# Altium schematic sheet 主控电路.SchDoc
size 304 x 152 mm
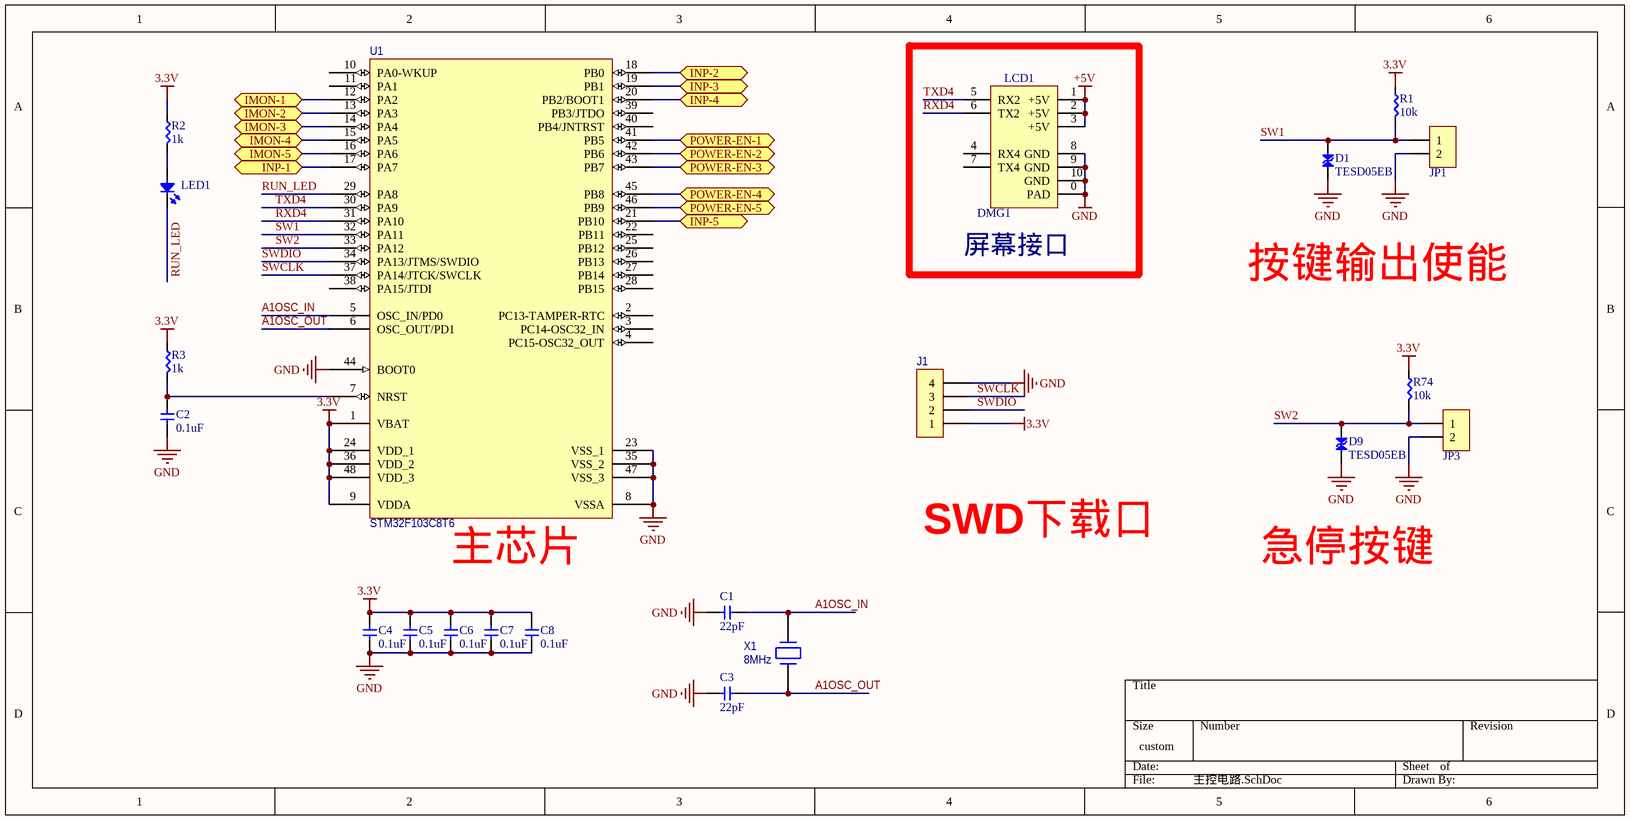
[diagram p0: 主控电路.SchDoc]

## Parts
C1  22pF  [C 0603_M]
C2  0.1uF  [C 0603_M]
C3  22pF  [C 0603_M]
C4  0.1uF  [C 0603_M]
C5  0.1uF  [C 0603_M]
C6  0.1uF  [C 0603_M]
C7  0.1uF  [C 0603_M]
C8  0.1uF  [C 0603_M]
D1  TESD05EB  [0603-ESD]
D9  TESD05EB  [0603-ESD]
DMG1  LCD1  [FCC1.0*10]
J1  swio  [HDR2.54-LI-4P]  (value not drawn)
JP1  HDR-1X2  [XH2.54-LI-2P]  (value not drawn)
JP3  HDR-1X2  [XH2.54-LI-2P]  (value not drawn)
LED1  LED  [LED 0603G]  (value not drawn)
R1  10k  [R 0603_M]
R2  1k  [R 0603_M]
R3  1k  [R 0603_M]
R74  10k  [R 0603_M]
U1  STM32F103C8T6  [LQFP48 7X7_M]
X1  8MHz  [OSC HC-49SMD]

## Blocks framed on the sheet
屏幕接口: DMG1

## Ports
IMON-1, IMON-2, IMON-3, IMON-4, IMON-5, INP-1, INP-2, INP-3, INP-4, INP-5, POWER-EN-1, POWER-EN-2, POWER-EN-3, POWER-EN-4, POWER-EN-5

## Nets
3.3V: C4.2 C5.2 C6.2 C7.2 C8.2 J1.1 R1.1 R2.1 R3.1 R74.1 U1.1(VBAT) U1.9(VDDA) U1.24(VDD_1) U1.36(VDD_2) U1.48(VDD_3)
+5V: DMG1.1(+5V) DMG1.2(+5V) DMG1.3(+5V)
GND: C1.2 C2.1 C3.2 C4.1 C5.1 C6.1 C7.1 C8.1 D1.1(A) D9.1(A) DMG1.0(PAD) DMG1.8(GND) DMG1.9(GND) DMG1.10(GND) J1.4 JP1.2 JP3.2 U1.8(VSSA) U1.23(VSS_1) U1.35(VSS_2) U1.44(BOOT0) U1.47(VSS_3)
A1OSC_IN: C1.1 U1.5(OSC_IN/PD0) X1.2
A1OSC_OUT: C3.1 U1.6(OSC_OUT/PD1) X1.1
IMON-1: U1.12(PA2) ; port IMON-1
IMON-2: U1.13(PA3) ; port IMON-2
IMON-3: U1.14(PA4) ; port IMON-3
IMON-4: U1.15(PA5) ; port IMON-4
IMON-5: U1.16(PA6) ; port IMON-5
INP-1: U1.17(PA7) ; port INP-1
INP-2: U1.18(PB0) ; port INP-2
INP-3: U1.19(PB1) ; port INP-3
INP-4: U1.20(PB2/BOOT1) ; port INP-4
INP-5: U1.21(PB10) ; port INP-5
POWER-EN-1: U1.41(PB5) ; port POWER-EN-1
POWER-EN-2: U1.42(PB6) ; port POWER-EN-2
POWER-EN-3: U1.43(PB7) ; port POWER-EN-3
POWER-EN-4: U1.45(PB8) ; port POWER-EN-4
POWER-EN-5: U1.46(PB9) ; port POWER-EN-5
RUN_LED: LED1.2(K) U1.29(PA8)
RXD4: DMG1.6(TX2) U1.31(PA10)
SW1: D1.2(K) JP1.1 R1.2 U1.32(PA11)
SW2: D9.2(K) JP3.1 R74.2 U1.33(PA12)
SWCLK: J1.3 U1.37(PA14/JTCK/SWCLK)
SWDIO: J1.2 U1.34(PA13/JTMS/SWDIO)
TXD4: DMG1.5(RX2) U1.30(PA9)
NetC2_2: C2.2 R3.2 U1.7(NRST)
NetLED1_1: LED1.1(A) R2.2

Not connected (* = marked no-connect by the designer): DMG1 4(RX4) 7(TX4); U1 2(PC13-TAMPER-RTC) 3(PC14-OSC32_IN) 4(PC15-OSC32_OUT) 10(PA0-WKUP) 11(PA1) 22(PB11) 25(PB12) 26(PB13) 27(PB14) 28(PB15) 38(PA15/JTDI) 39(PB3/JTDO) 40(PB4/JNTRST)

## Notes on the sheet
- 按键输出使能
- (near U1) 主芯片
- SWD下载口
- 急停按键

## Library data of the parts
C1-C8 = C
D1 D9 = D  TVS: Published: 8-Jun-2000; LatestRevisionDate: 17-Jul-2002; LatestRevisionNote: Re-released for DXP Platform.; PackageVersion: Sep-1996; PackageReference: SMC; Publisher: Altium Limited; PackageDescription: DO-214-AB/SMC; 2 C-Bend Leads; Body 7.9 x 5.9 mm, inc. leads (LxW); Code_JEDEC: DO-214-AB
DMG1 = DMG48480C040
J1 = HDR1x4: Connector
JP1 JP3 = Header 2: 2P接插件; 版权归属: 源创客; BOM名称: 2P接插件; 学习资源: www.ooocke.com
R1-R3 R74 = Res
U1 = STM32F103CBT6: STM32 ARM-based 32-bit MCU with 128 Kbytes Flash, 48-pin LQFP, Industrial Temperature; Published: 30-May-2008; DatasheetVersion: rev6, Mar-2008; PackageVersion: Mar-2008; PackageReference: LQFP48; Publisher: Altium Limited; PackageDescription: 48-Pin Low-Profile Quad Flat Pack, 7 x 7 mm Body, 0.5 mm Pitch (LQFP48); ComponentLink1Description: Manufacturer Link; ComponentLink1URL: www.st.com/stm32; ComponentLink2Description: Datasheet; ComponentLink2URL: http://www.st.com/stonline/products/literature/ds/13587.pdf
X1 = CRYSTAL
LED1 = LED: Published: 8-Jun-2000; LatestRevisionDate: 08-Jul-2005; LatestRevisionNote: Mech Layer 1 removed.; PackageReference: LED-0; Publisher: Altium Limited; PackageDescription: LED; 2 Leads